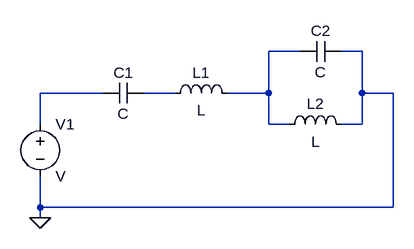
[diagram p0: schematic ejercicio1a.asc]
ejercicio1a.asc, the LTspice schematic file:
Version 4.1
SHEET 1 880 680
WIRE 384 48 336 48
WIRE 480 48 448 48
WIRE 80 112 -16 112
WIRE 192 112 144 112
WIRE 336 112 336 48
WIRE 336 112 272 112
WIRE 480 112 480 48
WIRE 528 112 480 112
WIRE -16 160 -16 112
WIRE 336 160 336 112
WIRE 368 160 336 160
WIRE 480 160 480 112
WIRE 480 160 448 160
WIRE -16 288 -16 240
WIRE 528 288 528 112
WIRE 528 288 -16 288
WIRE -16 304 -16 288
FLAG -16 304 0
SYMBOL cap 144 96 R90
WINDOW 0 0 32 VBottom 2
WINDOW 3 32 32 VTop 2
SYMATTR InstName C1
SYMBOL ind 176 128 R270
WINDOW 0 32 56 VTop 2
WINDOW 3 5 56 VBottom 2
SYMATTR InstName L1
SYMBOL ind 352 176 R270
WINDOW 0 32 56 VTop 2
WINDOW 3 5 56 VBottom 2
SYMATTR InstName L2
SYMBOL cap 448 32 R90
WINDOW 0 0 32 VBottom 2
WINDOW 3 32 32 VTop 2
SYMATTR InstName C2
SYMBOL voltage -16 144 R0
SYMATTR InstName V1

The netlist it stands for:
* ejercicio1a.asc
C1 N003 N002 C
L1 N003 N001 L
L2 N001 0 L
C2 0 N001 C
V1 N002 0 V
.backanno
.end